# Altium schematic sheet wifi_isolated_uart.SchDoc: Isolated_Wifi
size A4; Organization: UNSW Solar Racing Team; Address3: UNSW; Address4: Sydney NSW 2052; Address2: Electrical Engineering; Address1: Room 342
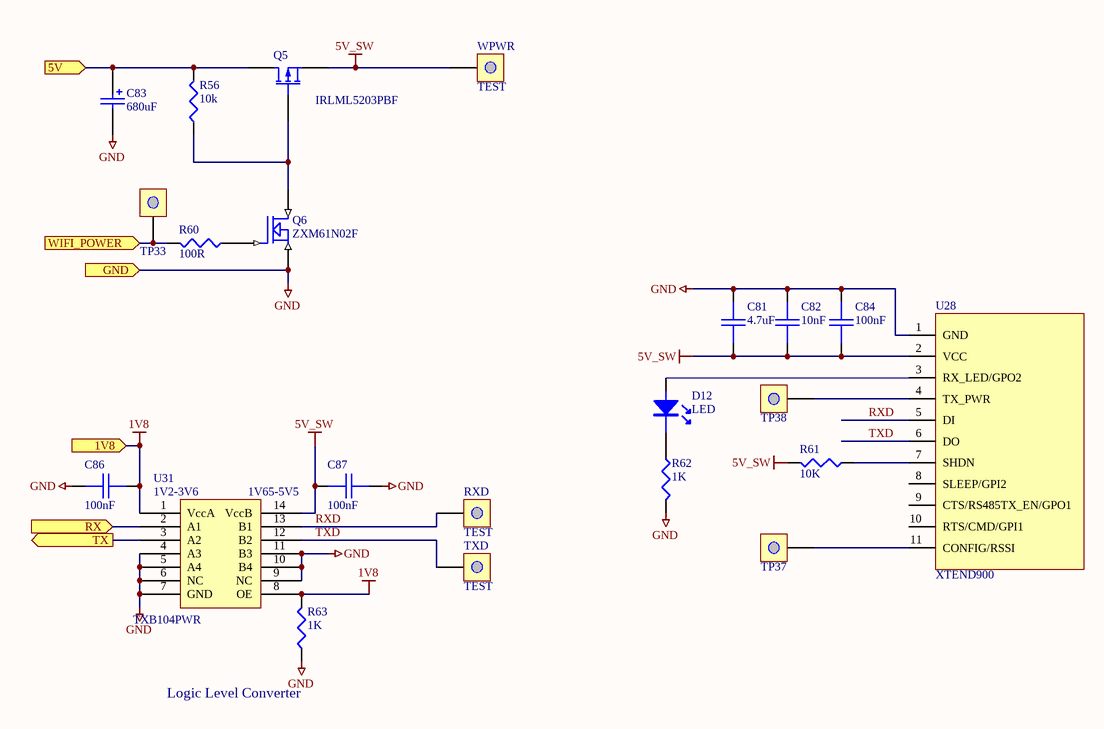
[diagram p0: wifi_isolated_uart.SchDoc]

## Parts
C81  4.7uF  [0603]
C82  10nF  [0603]
C83  680uF  [MCCT-CASED]
C84  100nF  [0603]
C86  100nF  [0603]
C87  100nF  [0603]
D12  LED  [0805LED]
Q5  IRLML5203PBF  [SOT23-3]
Q6  ZXM61N02F  [SOT23-3]
R56  10k  [0603]
R60  100R  [0603]
R61  10K  [0603]
R62  1K  [0603]
R63  1K  [0603]
RXD  TEST  [TESTPOINT]
TP33  WIFI_PWR  [TESTPOINT]  (value not drawn)
TP37  CFG  [TESTPOINT]  (value not drawn)
TP38  TX_PWR  [TESTPOINT]  (value not drawn)
TXD  TEST  [TESTPOINT]
U28  XTEND900  [XTEND900]
U31  TXB104PWR  [TSSOP14-L]
WPWR  TEST  [TESTPOINT]

## Ports
1V8 (in), 5V (in), GND (in), RX (in), TX (out), WIFI_POWER (in)

## Nets
1V8: C86.2 R63.2 U31.1(VccA) U31.8(OE) ; port 1V8
5V_SW: C81.2 C82.1 C84.1 C87.1 Q5.2(S) R61.2 U28.2(VCC) U31.14(VccB) WPWR.0(TP)
GND: C81.1 C82.2 C83.2 C84.2 C86.1 C87.2 Q6.2(S) R62.2 R63.1 U28.1(GND) U31.4(A3) U31.5(A4) U31.6(NC) U31.7(GND) U31.9(NC) U31.10(B4) U31.11(B3) ; port GND
5V: C83.1 Q5.3(D) R56.2 ; port 5V
RX: U31.2(A1) ; port RX
RXD: RXD.0(TP) U28.5(DI) U31.13(B1)
TX: U31.3(A2) ; port TX
TXD: TXD.0(TP) U28.6(DO) U31.12(B2)
WIFI_POWER: R60.2 TP33.0(TP) ; port WIFI_POWER
NetD12_A: D12.A U28.3(RX_LED/GPO2)
NetD12_K: D12.K R62.1
NetQ5_1: Q5.1(G) Q6.3(D) R56.1
NetQ6_1: Q6.1(G) R60.1
NetR61_1: R61.1 U28.7(SHDN)
NetTP37_0: TP37.0(TP) U28.11(CONFIG/RSSI)
NetTP38_0: TP38.0(TP) U28.4(TX_PWR)

Not connected (* = marked no-connect by the designer): U28 8(SLEEP/GPI2) 9(CTS/RS485TX_EN/GPO1) 10(RTS/CMD/GPI1)

## Notes on the sheet
- (near R63) Logic Level Converter
- Title
- Size:
- Date:
- A4
- Number:
- Time:
- Revision:
- Sheet
- of
- File:
- (in symbol TXB0104PWR) 1V2-3V6; 1V65-5V5

## Library data of the parts
C81 C82 C84 C86 C87 = CAP: Capacitor
  C81: Digikey: 587-1441-1-ND; Farnell: 1688134; DigikeyPrice: 0.42; FarnellPrice: 0.585
C83 = CAP POL3: Polarized Capacitor (Surface Mount); Revision: July-2002: Re-released for DXP Platform.; Farnell: 1612292; FarnellPrice: 10.99; Digikey: 478-1787-1-ND; DigikeyPrice: 6.85
Q5 = IRLML5203PBF: MOSFET P-type SOT-23-3; Farnell: 9103511; FarnellPrice: 0.71
Q6 = ZXM61N02F: 1.7A, 20V N-Channel Enhancement mode FET; Digikey: ZXM61N02FCT-ND; DigikeyPrice: 0.66; Farnell: 9525270; FarnellPrice: 1.35
R56 R60-R63 = RES1: Resistor
RXD TP33 TP37 TP38 TXD WPWR = TEST: TEST POINT
U28 = XTEND900: Digi XTEND900 Radio Modem; Sparkfun: WRL-09411; SparkfunPrice: 184.95; Digikey: 3M1320-ND; DigikeyPrice: 2.02
U31 = TXB0104PWR: 4 bit bidirectional auto direction sense level translator; Digikey: 296-21929-1-ND; Farnell: 1607891; FarnellPrice: 3.1; DigikeyPrice: 1.93
D12 = LED: Farnell: *; Digikey: 475-1151-1-ND; DigikeyPrice: 0.28